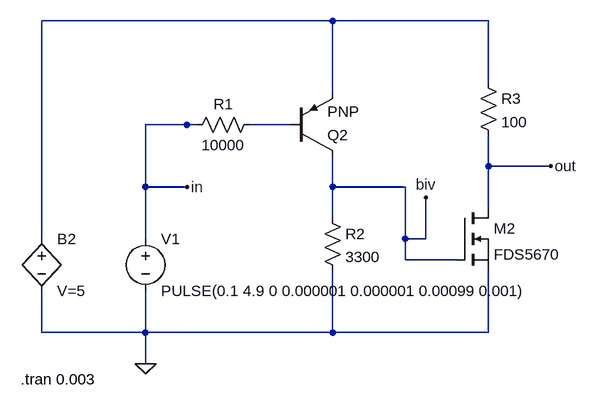
[diagram p0: schematic Badlicht.asc]
Badlicht.asc, the LTspice schematic file:
Version 4
SHEET 1 1016 680
WIRE 224 -160 -224 -160
WIRE 464 -160 224 -160
WIRE 464 -64 464 -160
WIRE 224 -48 224 -160
WIRE 16 0 -64 0
WIRE 160 0 96 0
WIRE 464 64 464 16
WIRE 560 64 464 64
WIRE -64 96 -64 0
WIRE 0 96 -64 96
WIRE 224 96 224 48
WIRE 336 96 224 96
WIRE 464 128 464 64
WIRE 224 144 224 96
WIRE -224 176 -224 -160
WIRE -64 176 -64 96
WIRE 336 176 336 96
WIRE 368 176 368 112
WIRE 368 176 336 176
WIRE 336 208 336 176
WIRE 416 208 336 208
WIRE -224 320 -224 256
WIRE -64 320 -64 256
WIRE -64 320 -224 320
WIRE 224 320 224 224
WIRE 224 320 -64 320
WIRE 464 320 464 224
WIRE 464 320 224 320
WIRE -64 368 -64 320
WIRE 0 0 0 0
FLAG -64 368 0
FLAG 560 64 out
FLAG 0 96 in
FLAG 368 112 biv
SYMBOL res 112 -16 R90
WINDOW 0 0 56 VBottom 2
WINDOW 3 32 56 VTop 2
SYMATTR InstName R1
SYMATTR Value 10000
SYMBOL bv -224 160 R0
SYMATTR InstName B2
SYMATTR Value V=5
SYMBOL res 208 128 R0
SYMATTR InstName R2
SYMATTR Value 3300
SYMBOL res 448 -80 R0
SYMATTR InstName R3
SYMATTR Value 100
SYMBOL pnp 160 48 M180
SYMATTR InstName Q2
SYMBOL voltage -64 160 R0
WINDOW 123 0 0 Left 2
WINDOW 39 0 0 Left 2
SYMATTR InstName V1
SYMATTR Value PULSE(0.1 4.9 0 0.000001 0.000001 0.00099 0.001)
SYMBOL nmos 416 128 R0
SYMATTR InstName M2
SYMATTR Value FDS5670
TEXT -256 392 Left 2 !.tran 0.003

The netlist it stands for:
* Badlicht.asc
R1 N002 in 10000
B2 N001 0 V=5
R2 biv 0 3300
R3 N001 out 100
Q2 biv N002 N001 0 PNP
V1 in 0 PULSE(0.1 4.9 0 0.000001 0.000001 0.00099 0.001)
M2 out biv 0 0 FDS5670
.model NPN NPN
.model PNP PNP
.lib standard.bjt
.model NMOS NMOS
.model PMOS PMOS
.lib standard.mos
.tran 0.003
.backanno
.end